# EAGLE design KMO_IO_MV1_1a (EAGLE 9.2.2)

## Sheet 1 of 2
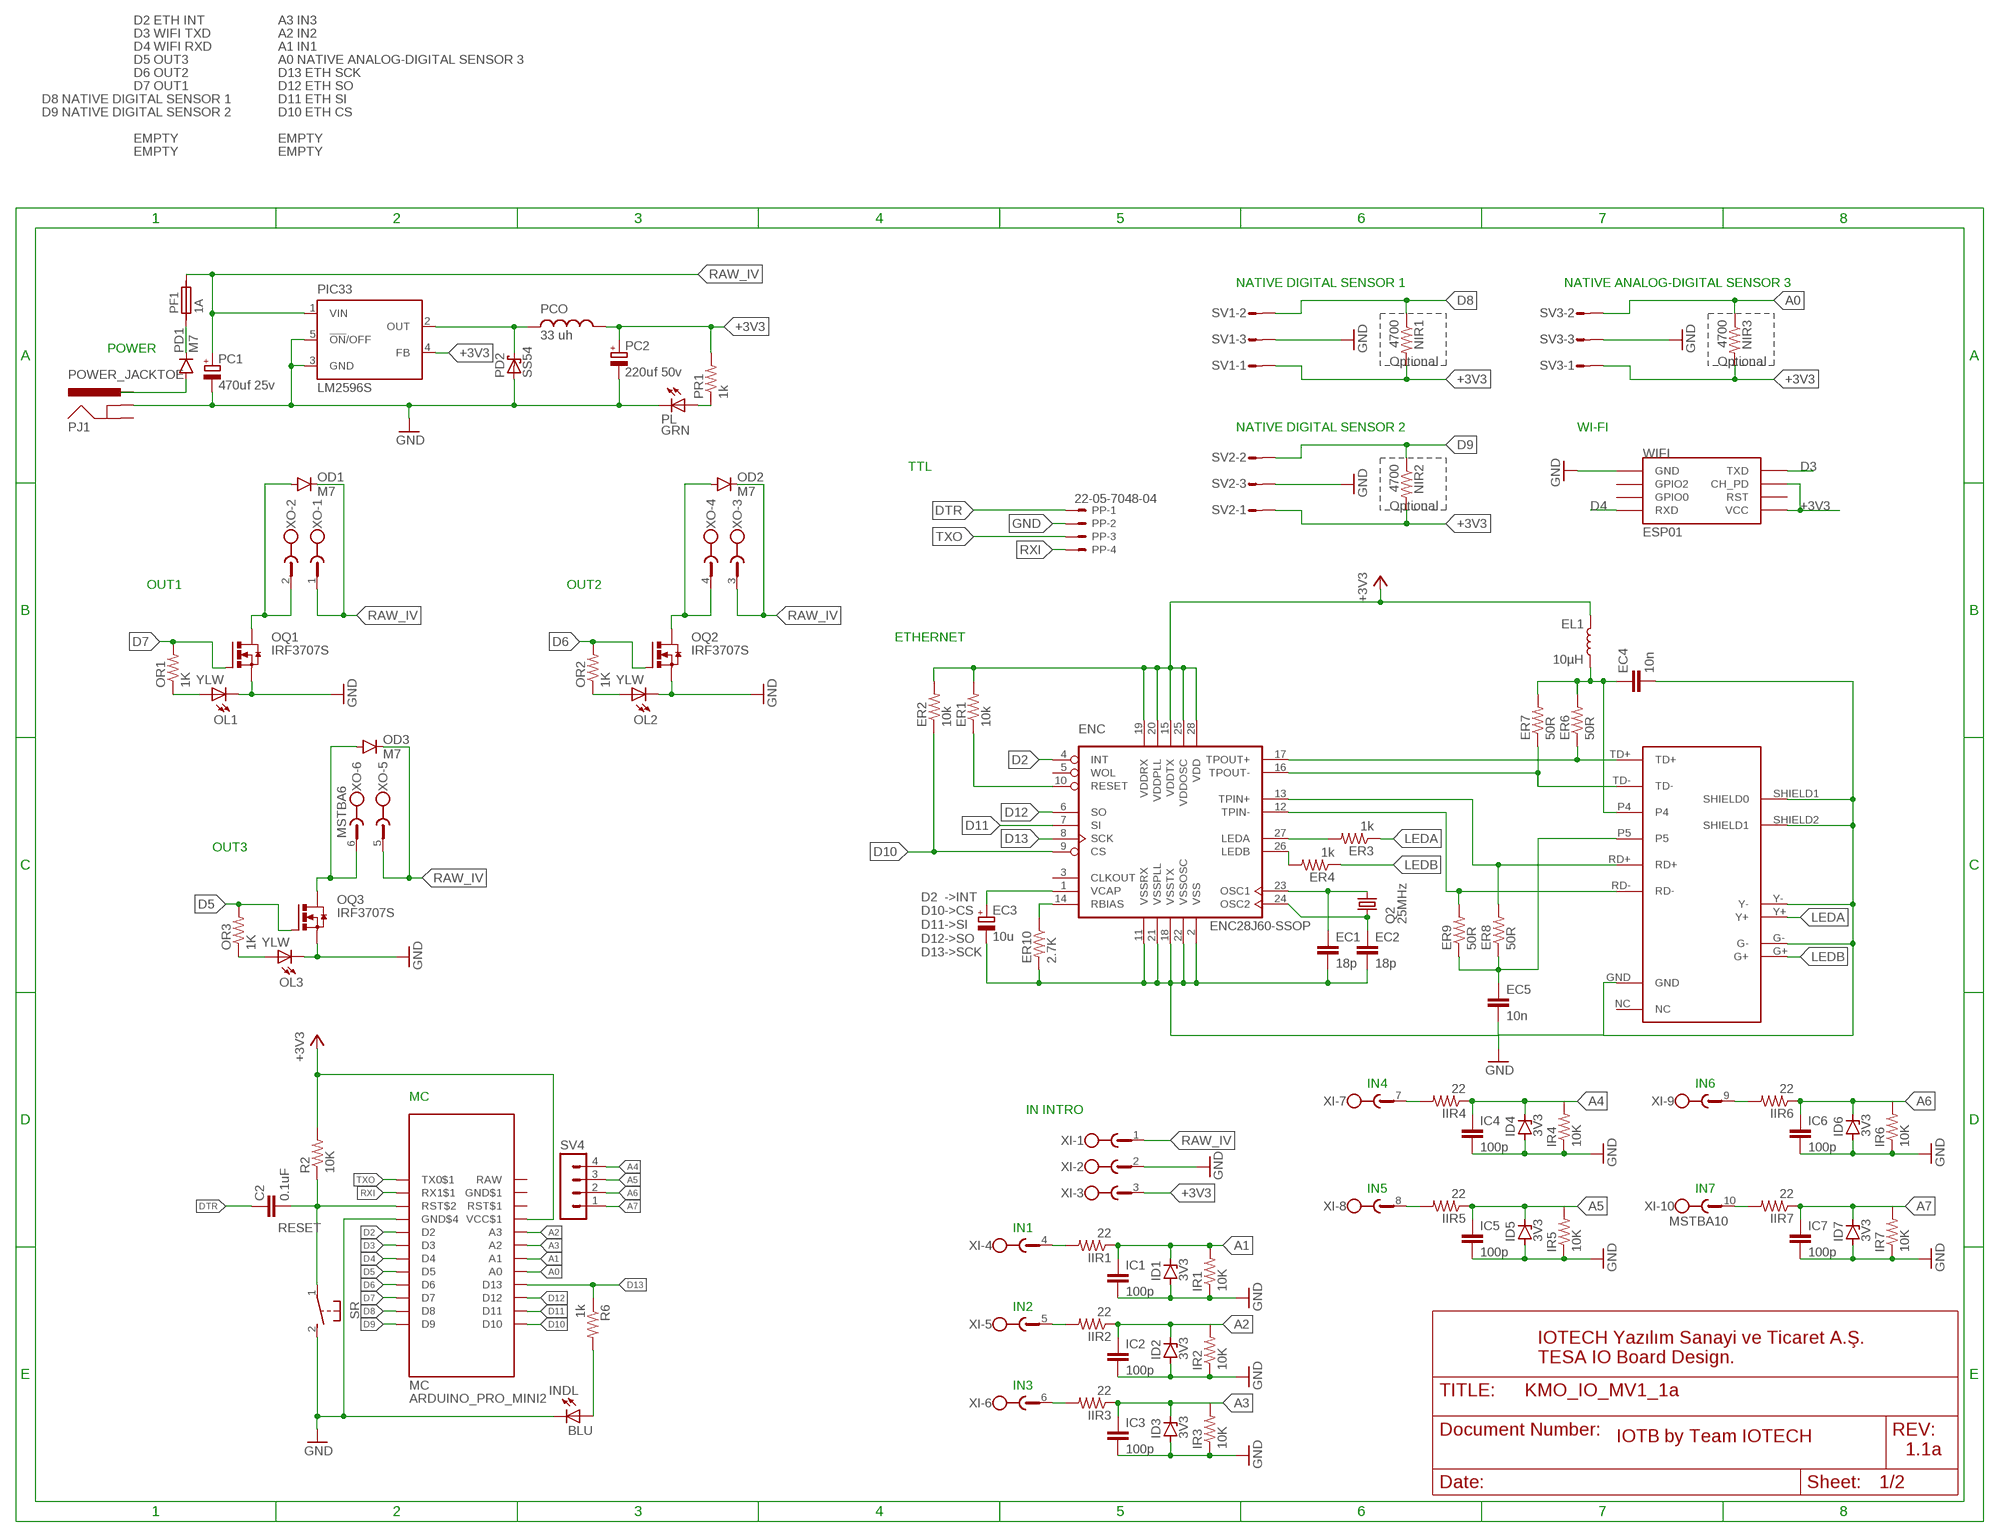
[diagram p0: schematic, sheet 1]

### Parts
C2  0.1uF  CAP0805  [0805]
EC1  18p  CAP0805  [0805]
EC2  18p  CAP0805  [0805]
EC3  10u  CPOL-EUCT3216  [CT3216]
EC4  10n  CAP0805  [0805]
EC5  10n  CAP0805  [0805]
EL1  10µH  INDUCTOR-0805-3.3UH  [0805]
ENC  ENC28J60-SSOP  [SSOP28]
ER1  10k  RESISTOR0805-RES  [0805]
ER2  10k  RESISTOR0805-RES  [0805]
ER3  1k  RESISTOR0805-RES  [0805]
ER4  1k  RESISTOR0805-RES  [0805]
ER6  50R  RESISTOR0805-RES  [0805]
ER7  50R  RESISTOR0805-RES  [0805]
ER8  50R  RESISTOR0805-RES  [0805]
ER9  50R  RESISTOR0805-RES  [0805]
ER10  2.7K  RESISTOR0805-RES  [0805]
IC1  100p  CAP0805  [0805]
IC2  100p  CAP0805  [0805]
IC3  100p  CAP0805  [0805]
IC4  100p  CAP0805  [0805]
IC5  100p  CAP0805  [0805]
IC6  100p  CAP0805  [0805]
IC7  100p  CAP0805  [0805]
ID1  3V3  ZENER-DIODESOT23  [SOT23]
ID2  3V3  ZENER-DIODESOT23  [SOT23]
ID3  3V3  ZENER-DIODESOT23  [SOT23]
ID4  3V3  ZENER-DIODESOT23  [SOT23]
ID5  3V3  ZENER-DIODESOT23  [SOT23]
ID6  3V3  ZENER-DIODESOT23  [SOT23]
ID7  3V3  ZENER-DIODESOT23  [SOT23]
IIR1  22  RESISTOR0805-RES  [0805]
IIR2  22  RESISTOR0805-RES  [0805]
IIR3  22  RESISTOR0805-RES  [0805]
IIR4  22  RESISTOR0805-RES  [0805]
IIR5  22  RESISTOR0805-RES  [0805]
IIR6  22  RESISTOR0805-RES  [0805]
IIR7  22  RESISTOR0805-RES  [0805]
INDL  BLU  LEDCHIP-LED0805  [CHIP-LED0805]
IR1  10K  RESISTOR0805-RES  [0805]
IR2  10K  RESISTOR0805-RES  [0805]
IR3  10K  RESISTOR0805-RES  [0805]
IR4  10K  RESISTOR0805-RES  [0805]
IR5  10K  RESISTOR0805-RES  [0805]
IR6  10K  RESISTOR0805-RES  [0805]
IR7  10K  RESISTOR0805-RES  [0805]
MC  ARDUINO_PRO_MINI2  [ARDUINO_PRO_MINI2]
NIR1  4700  RESISTOR0805-RES  [0805]
NIR2  4700  RESISTOR0805-RES  [0805]
NIR3  4700  RESISTOR0805-RES  [0805]
OD1  M7  DIODESMA  [SMA-DIODE]
OD2  M7  DIODESMA  [SMA-DIODE]
OD3  M7  DIODESMA  [SMA-DIODE]
OL1  YLW  LEDCHIP-LED0805  [CHIP-LED0805]
OL2  YLW  LEDCHIP-LED0805  [CHIP-LED0805]
OL3  YLW  LEDCHIP-LED0805  [CHIP-LED0805]
OQ1  IRF3707S  IRF3704S  [D2PACK]
OQ2  IRF3707S  IRF3704S  [D2PACK]
OQ3  IRF3707S  IRF3704S  [D2PACK]
OR1  1K  RESISTOR0805-RES  [0805]
OR2  1K  RESISTOR0805-RES  [0805]
OR3  1K  RESISTOR0805-RES  [0805]
PC1  470uf 25v  CPOL-EU140CLH-1010  [140CLH-1010]
PC2  220uf 50v  CPOL-EU140CLH-1010  [140CLH-1010]
PCO  33 uh  MSS1260  [MSS1260]
PD1  M7  DIODESMA  [SMA-DIODE]
PD2  SS54  SCHOTTKY-DIODESMD  [SMB]
PF1  1A  SIBA194600  [1820]
PIC33  LM2596S  [TO263-5]
PJ1  POWER_JACKTOE  [POWER_JACK_SMD_OVERPASTE_TOE]
PL  GRN  LEDCHIP-LED0805  [CHIP-LED0805]
PP  22-05-7048-04  [7395-04]
PR1  1k  RESISTOR0805-RES  [0805]
Q2  25MHz  KX-9B  [5.0X3.2_2]
R2  10K  RESISTOR0805-RES  [0805]
R6  1k  RESISTOR0805-RES  [0805]
SR  31-XX  [B3F-31XX]
SV1  S03P  [S03P]
SV2  S03P  [S03P]
SV3  S03P  [S03P]
SV4  MA04-1  [MA04-1]
U$2  HR911105A  [RJ45]
WIFI  ESP01  [ESP01]
XI  MSTBA10  [MSTBA10]
XO  MSTBA6  [MSTBA6]

### Nets
+3V3: EL1.1 ENC.15(VDDTX) ENC.19(VDDRX) ENC.20(VDDPLL) ENC.25(VDDOSC) ENC.28(VDD) ER1.2 ER2.2 MC.VCC$1 NIR1.2 NIR2.2 NIR3.2 PC2.+ PCO.P$1 PIC33.4(FB) PR1.2 R2.2 SV1.1 SV2.1 SV3.1 WIFI.CH_PD WIFI.VCC XI.3
A0: MC.A0 NIR3.1 SV3.2
A1: IC1.1 ID1.3(C) IIR1.1 IR1.2 MC.A1
A2: IC2.1 ID2.3(C) IIR2.1 IR2.2 MC.A3
A3: IC3.1 ID3.3(C) IIR3.1 IR3.2 MC.A2
A4: IC4.1 ID4.3(C) IIR4.1 IR4.2 SV4.4
A5: IC5.1 ID5.3(C) IIR5.1 IR5.2 SV4.3
A6: IC6.1 ID6.3(C) IIR6.1 IR6.2 SV4.2
A7: IC7.1 ID7.3(C) IIR7.1 IR7.2 SV4.1
D2: ENC.4(INT) MC.D2
D3: MC.D3 WIFI.TX(TXD)
D4: MC.D4 WIFI.RX(RXD)
D5: MC.D5 OQ3.1(G) OR3.2
D6: MC.D6 OQ2.1(G) OR2.2
D7: MC.D7 OQ1.1(G) OR1.2
D8: MC.D8 NIR1.1 SV1.2
D9: MC.D9 NIR2.1 SV2.2
D10: ENC.9(CS) ER2.1 MC.D10
D11: ENC.7(SI) MC.D11
D12: ENC.6(SO) MC.D12
D13: ENC.8(SCK) MC.D13 R6.1
DTR: C2.2 PP.1
EP4: EC4.1 EL1.2 ER6.2 ER7.2 U$2.P4
EP5: EC5.1 ER8.1 ER9.1 U$2.P5
GND: EC1.2 EC2.2 EC3.- EC4.2 EC5.2 ENC.2(VSS) ENC.11(VSSRX) ENC.18(VSSTX) ENC.21(VSSPLL) ENC.22(VSSOSC) ER10.2 IC1.2 IC2.2 IC3.2 IC4.2 IC5.2 IC6.2 IC7.2 ID1.1(A) ID2.1(A) ID3.1(A) ID4.1(A) ID5.1(A) ID6.1(A) ID7.1(A) INDL.C IR1.1 IR2.1 IR3.1 IR4.1 IR5.1 IR6.1 IR7.1 MC.GND$4 OL1.C OL2.C OL3.C OQ1.3(S) OQ2.3(S) OQ3.3(S) PC1.- PC2.- PD2.A PIC33.3(GND) PIC33.5(!ON!/OFF) PJ1.GND(GNDBREAK) PL.C PP.2 SR.2(S) SV1.3 SV2.3 SV3.3 U$2.G- U$2.GND U$2.SHIELD1(SHIELD0) U$2.SHIELD2(SHIELD1) U$2.Y- WIFI.GND XI.2
LEDA: ER3.1 U$2.Y+
LEDB: ER4.1 U$2.G+
N$1: OD3.A OQ3.2(D) XO.6
N$2: PD1.C PF1.1
N$3: OD1.A OQ1.2(D) XO.2
N$4: OD2.A OQ2.2(D) XO.4
N$5: INDL.A R6.2
N$6: OL3.A OR3.1
N$7: OL2.A OR2.1
N$8: OL1.A OR1.1
N$9: ENC.27(LEDA) ER3.2
N$11: PL.A PR1.1
N$12: IIR1.2 XI.4
N$13: EC3.+ ENC.1(VCAP)
N$14: ENC.26(LEDB) ER4.2
N$16: PCO.P$2 PD2.C PIC33.2(OUT)
N$17: ENC.10(RESET) ER1.1
N$18: PD1.A PJ1.VIN0(PWR)
N$19: ENC.14(RBIAS) ER10.1
N$20: IIR2.2 XI.5
N$21: IIR3.2 XI.6
N$22: EC2.1 ENC.24(OSC2) Q2.1
N$23: IIR4.2 XI.7
N$24: EC1.1 ENC.23(OSC1) Q2.2
N$25: IIR5.2 XI.8
N$26: IIR6.2 XI.9
N$27: IIR7.2 XI.10
RAW_IV [vcc]: OD1.C OD2.C OD3.C PC1.+ PF1.2 PIC33.1(VIN) XI.1 XO.1 XO.3 XO.5
RD+: ENC.13(TPIN+) ER8.2 U$2.RD+
RD-: ENC.12(TPIN-) ER9.2 U$2.RD-
RESET: C2.1 MC.RST$2 R2.1 SR.1(P)
RXI: MC.RX1$1 PP.4
TD+: ENC.17(TPOUT+) ER6.1 U$2.TD+
TD-: ENC.16(TPOUT-) ER7.1 U$2.TD-
TXO: MC.TX0$1 PP.3
Unconnected: ENC.3(CLKOUT) ENC.5(WOL) MC.RST$1 PJ1.P$4(GND) U$2.NC WIFI.GPIO0 WIFI.GPIO2 WIFI.RST

### Notes on the sheet
- D2 ETH INT | A3 IN3
- D3 WIFI TXD | A2 IN2
- D4 WIFI RXD | A1 IN1
- D5 OUT3 | A0 NATIVE ANALOG-DIGITAL SENSOR 3
- D6 OUT2 | D13 ETH SCK
- D7 OUT1 | D12 ETH SO
- D8 NATIVE DIGITAL SENSOR 1 | D11 ETH SI
- D9 NATIVE DIGITAL SENSOR 2 | D10 ETH CS
- EMPTY | EMPTY
- EMPTY | EMPTY
- NATIVE DIGITAL SENSOR 1 | NATIVE ANALOG-DIGITAL SENSOR 3
- POWER
- Optional | Optional
- NATIVE DIGITAL SENSOR 2 | WI-FI
- TTL
- Optional
- OUT1 | OUT2
- ETHERNET
- OUT3
- D2  ->INT
  D10->CS
  D11->SI
  D12->SO
  D13->SCK
- IN4 | IN6
- MC
- IN INTRO
- IN5 | IN7
- IN1
- IN2
- IOTECH Yazılım Sanayi ve Ticaret A.Ş.
  TESA IO Board Design.
- IN3
- IOTB by Team IOTECH
- 1.1a

## Sheet 2 of 2
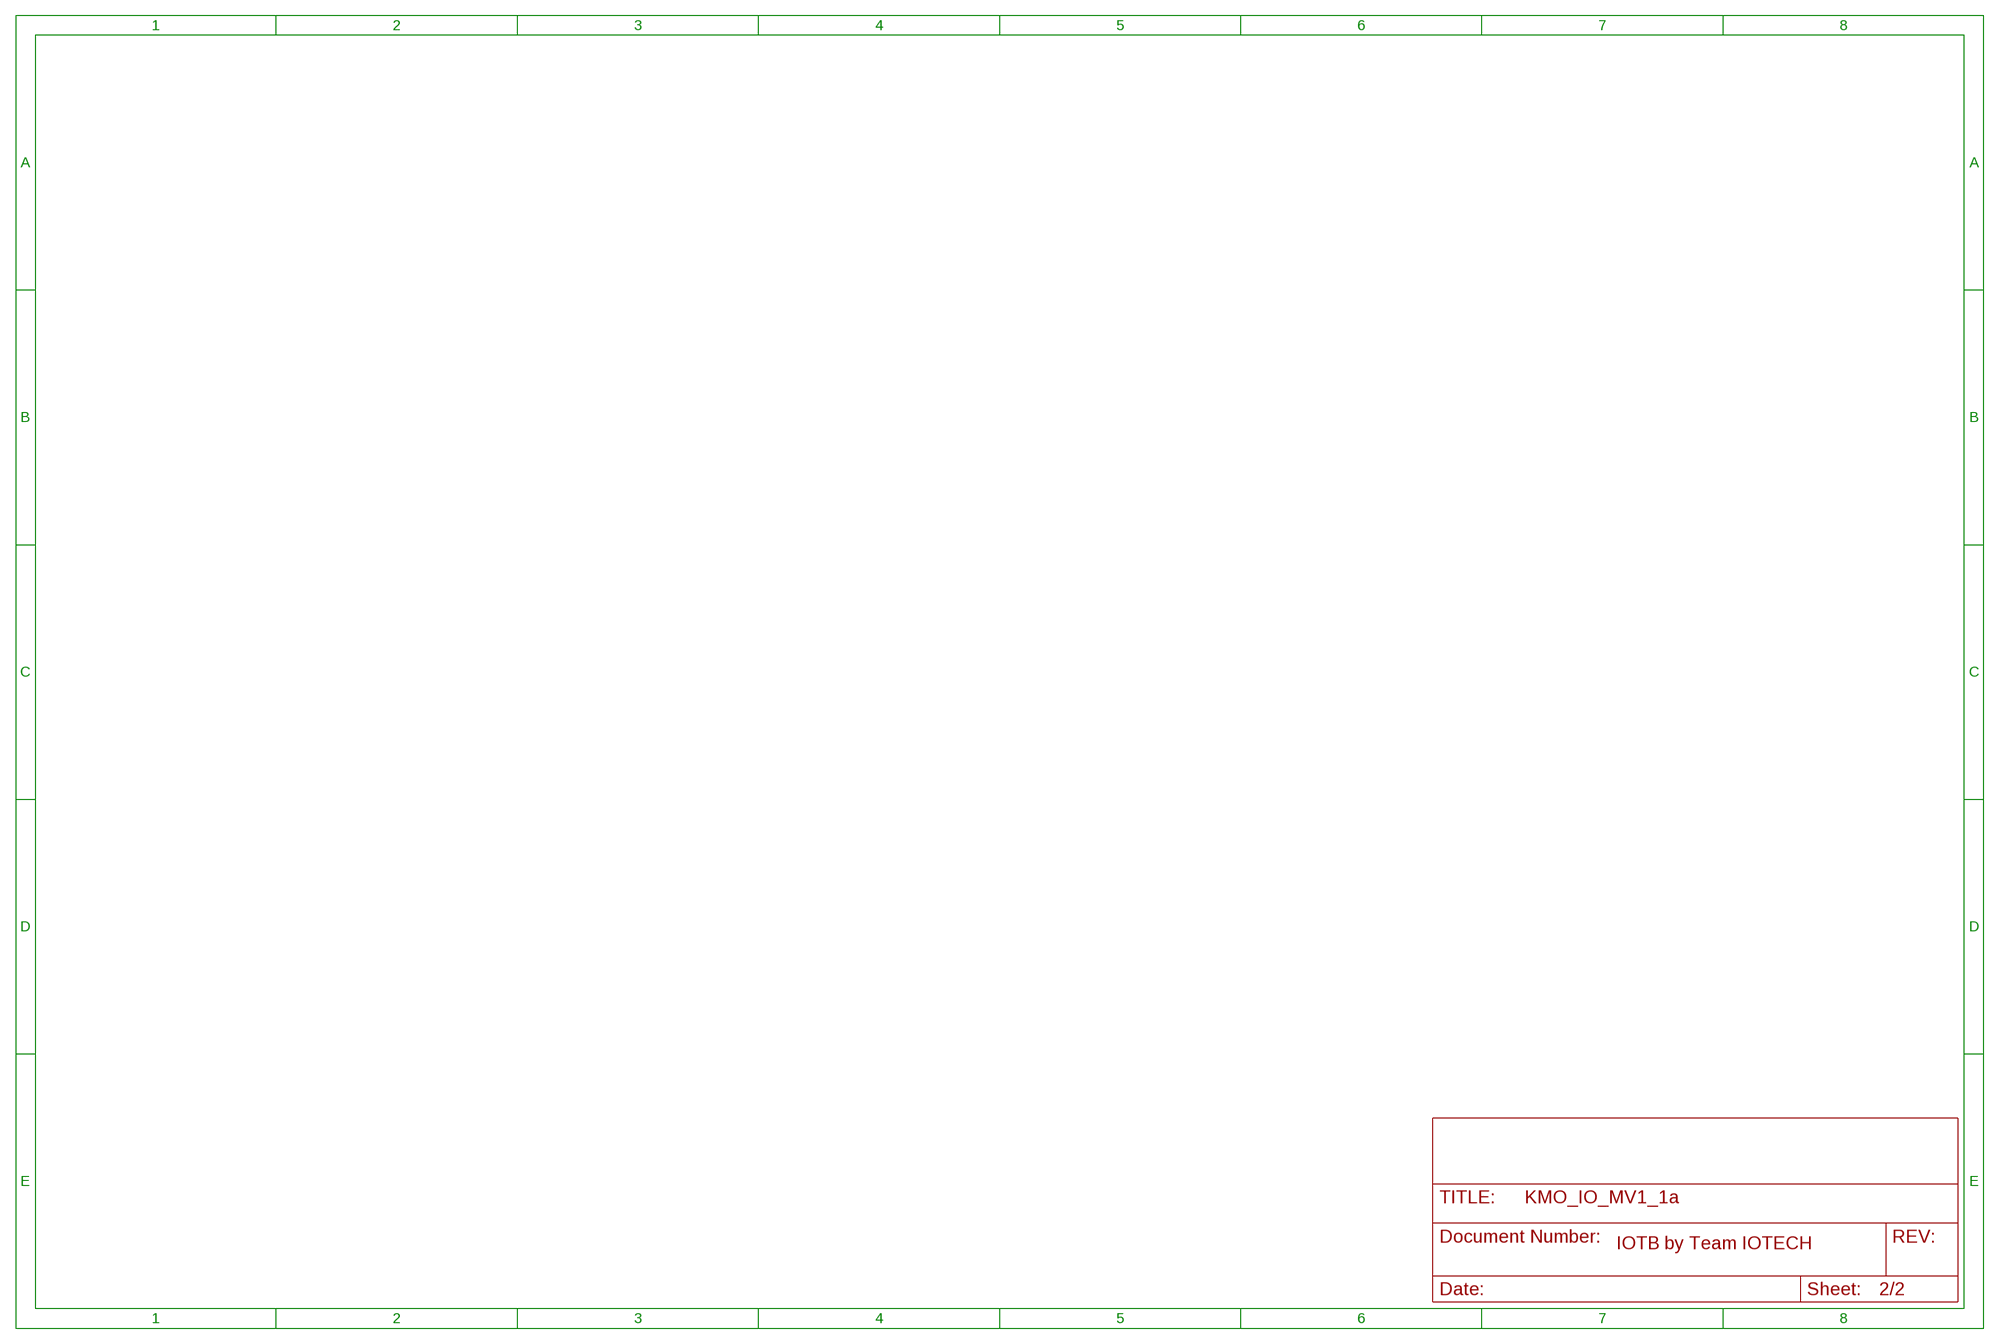
[diagram p1: schematic, sheet 2]

### Notes on the sheet
- IOTB by Team IOTECH

## Power pins joined to a net without a drawn wire
GND$1: MC.GDN$1(GND$1)
RAW: MC.RAW

## Library data of the parts
C2 EC1 EC2 EC4 EC5 IC1-IC7 = SparkFun-Passives:CAP: Capacitor Standard 0603 ceramic capacitor, and 0.1" leaded capacitor.
EC3 PC1 PC2 = rcl:CPOL-EU: POLARIZED CAPACITOR, European symbol; SPICEPREFIX: C
EL1 = SparkFun-Coils:INDUCTOR: Inductors Resist changes in electrical current. Basically a coil of wire. SparkFun Products: SparkFun Load Cell Amplifier - HX711 <https://www.sparkfun.com/products/13879> IOIO-OTG - V2.2 <https://www.sparkfun.com/products/13613>; PROD_ID: NDUC-13076; VALUE: 3.3µH/±20%/450mA
ENC = microchip-enc28j60:ENC28J60-*: Microchip 10Mbit Eth. contoller with SPI interface
ER1-ER4 ER6-ER10 IIR1-IIR7 IR1-IR7 NIR1-NIR3 OR1-OR3 PR1 R2 R6 = SparkFun-Passives:RESISTOR: Resistor Basic schematic elements and footprints for 0603, 1206, and PTH resistors.
ID1-ID7 = diode:ZENER-DIODE: Z-Diode
INDL OL1-OL3 PL = led:LED: LED OSRAM: - CHIPLED LG R971, LG N971, LY N971, LG Q971, LY Q971, LO R971, LY R971 LH N974, LH R974 LS Q976, LO Q976, LY Q976 LO Q996 - Hyper CHIPLED LW Q18S LB Q993, LB Q99A, LB R99A - SideLED LS A670, LO A670, LY A670, LG A670, LP A670 LB A673, LV A673, LT A673, LW A673 LH A674 LY A675 LS A676, LA A676, LO A676, LY A676, LW A676 LS A679, LY A679, LG A679 - Hyper Micro SIDELED® LS Y876, LA Y876, LO Y876, LY Y876 LT Y87S - SmartLED LW L88C, LW L88S LB L89C, LB L89S, LG L890 LS L89K, LO L89K, LY L89K LS L896, LA L896, LO L896, LY L896 - TOPLED LS T670, LO T670, LY T670, LG T670, LP T670 LSG T670, LSP T670, LSY T670, LOP T670, LYG T670 LG T671, LOG T671, LSG T671 LB T673, LV T673, LT T673, LW T673 LH T674 LS T676, LA T676, LO T676, LY T676, LB T676, LH T676, LSB T676, LW T676 LB T67C, LV T67C, LT T67C, LS T67K, LO T67K, LY T67K, LW E67C LS E67B, LA E67B, LO E67B, LY E67B, LB E67C, LV E67C, LT E67C LW T67C LS T679, LY T679, LG T679 LS T770, LO T770, LY T770, LG T770, LP T770 LB T773, LV T773, LT T773, LW T773 LH T774 LS E675, LA E675, LY E675, LS T675 LS T776, LA T776, LO T776, LY T776, LB T776 LHGB T686 LT T68C, LB T68C - Hyper Mini TOPLED® LB M676 - Mini TOPLED Santana® LG M470 LS M47K, LO M47K, LY M47K Source: http://www.osram.convergy.de LUXEON: - LUMILED® LXK2-PW12-R00, LXK2-PW12-S00, LXK2-PW14-U00, LXK2-PW14-V00 LXK2-PM12-R00, LXK2-PM12-S00, LXK2-PM14-U00 LXK2-PE12-Q00, LXK2-PE12-R00, LXK2-PE12-S00, LXK2-PE14-T00, LXK2-PE14-U00 LXK2-PB12-K00, LXK2-PB12-L00, LXK2-PB12-M00, LXK2-PB14-N00, LXK2-PB14-P00, LXK2-PB14-Q00 LXK2-PR12-L00, LXK2-PR12-M00, LXK2-PR14-Q00, LXK2-PR14-R00 LXK2-PD12-Q00, LXK2-PD12-R00, LXK2-PD12-S00 LXK2-PH12-R00, LXK2-PH12-S00 LXK2-PL12-P00, LXK2-PL12-Q00, LXK2-PL12-R00 Source: www.luxeon.com KINGBRIGHT: KA-3528ASYC Source: www.kingbright.com
MC = personal_srgPersonal:ARDUINO_PRO_MINI2
OD1-OD3 PD1 = SparkFun-DiscreteSemi:DIODE: Diode These are standard reverse protection diodes and small signal diodes. SMA package can handle up to about 1A. SOD-323 can handle about 200mA. What the SOD-323 package when ordering, there are some mfgs out there that are 5-pin packages.
OQ1-OQ3 = transistor-power:IRF3704: SMPS MOSFET HEXFET® Power MOSFET Source: http://www.irf.com/product-info/datasheets/data/irf3704.pdf
PCO = inductor-coilcraft:MSS1260: SMT Power Inductor
PD2 = diode:SCHOTTKY-DIODE: Schottky Diode
PF1 = _hhn_PtcFuses_Siba_r500_Ozan:SIBA194600*: SIBA PTC-Fuses, Series 194600, 1812 (4.5 3.2)mm Source: www.siba.de/ Package: SMD 1812 (4.5 x 3.2)mm Technologies: SIBA194600Axxx xxx: Trip-Current * 10 mA Author: Dipl.-Ing. FH Rainer Bayer
PIC33 = national-semiconductor:LM2596: SIMPLE SWITCHER® Power Converter 150 kHz 3A Step-Down Voltage Regulator Source: http://www.national.com/ds/LM/LM2596.pdf; MF: NATIONAL SEMICONDUCTOR; MPN: LM2596S-ADJ/NOPB; OC_FARNELL: 9494367; OC_NEWARK: 41K3842
PJ1 = SparkFun-Connectors:POWER_JACK: Power Jack Connector This is the standard 5.5mm barrel jack for power. The PTH is the most common, proven, reliable, footprint. The Slot footprint only works if the mill layer is transmitted to the PCB fab house so be warned. Here are the connectors we sell at SparkFun: DC Barrel Power Jack/Connector <https://www.sparkfun.com/products/119> (PRT-00119) DC Barrel Power Jack/Connector (SMD) <https://www.sparkfun.com/products/12748> (PRT-12748) DC Barrel Jack Adapter - Breadboard Compatible <https://www.sparkfun.com/products/10811> (PRT-10811) It is used on this SparkFun product (and many, many others): SparkFun RedBoard - Programmed with Arduino <https://www.sparkfun.com/products/12757> (DEV-12757) Also, if you need a mating power supply or connector, please check these out: Wall Adapter Power Supply - 9VDC 650mA <https://www.sparkfun.com/products/298> (TOL-00298) DC Barrel Jack Adapter - Male <https://www.sparkfun.com/products/10287> (PRT-10287); PROD_ID: CONN-08106; SF_ID: PRT-12748
PP = con-molex:22-?-04: CONNECTOR wire to board 2.54 mm (.1 inch) pitch header; MF: MOLEX; OC_FARNELL: unknown; OC_NEWARK: unknown
Q2 = crystal-geyer_V1_0:KX: Quartz Crystals (MHz) SMD: KX - Serie Model Size l/w/h [mm] Frequency Range Frequency Stability Temp. Range [°C] Load Capacitance AECQ 200 availabel Datasheet KX-4 KX-5 KX-6 KX-7 KX-9A KX-9B KX-12A KX-12B KX-13 KX-20 KX-K KX-KS 1.6/1.2/0.3 2.0/1.6/0.45 2.5/2.0/0.55 3.2/2.5/0.8 5.0/3.2/1.0 5.0/3.2/1.1 6.0/3.5/1.1 6.0/3.5/1.0 7.0/5.0 /1.3 11.6/5.5/1.6 12.3/4.5/4.2 12.3/4.5/3.2 24.0 ~ 80.0 MHz 16.0 ~ 80.0 MHz 12.0 ~ 80.0 MHz 8.0 ~ 60.0 MHz 7,68 ~ 300,0 MHz 8,0 ~ 50,0 MHz 8,0 ~ 150,0 MHz 8,0 ~ 50,0 MHz 6,0 ~ 160,0 MHz 3,579 ~ 25,0 MHz 3,579 ~ 70,0 MHz 3,579 ~ 70,0 MHz ±10 … ±50ppm ±10 … ±50ppm ±10 … ±50ppm ±10 … ±50ppm ±10 … ±50ppm ±10 … ±50ppm ±10 … ±50ppm ±10 … ±50ppm ±10 … ±50ppm ±50ppm ±10 … ±50ppm ±10 … ±50ppm (*) -40°C …+85°C (*) -40°C …+125°C (*) -40°C …+125°C (*) -40°C …+125°C (*) -40°C …+105°C (*) -40°C …+105°C (*) -40°C …+125°C (*) -40°C …+105°C (*) -40°C …+105°C (*) -40°C …+105°C (*) -40°C …+85°C (*) -40°C …+85°C 8, 8…16 8, 8…16 10, 8…16 12, 7…20 16, 10…20 16, 10…20 16, 10…20 16, 12…20 16, 12…20 16, 12…20 16, 12…30 16, 12…30 - yes yes yes - - - - - - - - KX-4.pdf <http://www.geyer-electronic.de/uploads/tx_userartikelfrequenz/GEYER-KX-4.pdf> KX-5.pdf <http://www.geyer-electronic.de/uploads/tx_userartikelfrequenz/GEYER-KX-5.pdf> KX-6.pdf <http://www.geyer-electronic.de/uploads/tx_userartikelfrequenz/GEYER-KX-6.pdf> KX-7.pdf <http://www.geyer-electronic.de/uploads/tx_userartikelfrequenz/GEYER-KX-7.pdf> KX-9A.pdf <http://www.geyer-electronic.de/uploads/tx_userartikelfrequenz/GEYER-KX-9A.pdf> KX-9B.pdf <http://www.geyer-electronic.de/uploads/tx_userartikelfrequenz/GEYER-KX-9B.pdf> KX-12A.pdf <http://www.geyer-electronic.de/uploads/tx_userartikelfrequenz/GEYER-KX-12A.pdf> KX-12B.pdf <http://www.geyer-electronic.de/uploads/tx_userartikelfrequenz/GEYER-KX-12B.pdf> KX-13.pdf <http://www.geyer-electronic.de/uploads/tx_userartikelfrequenz/GEYER-KX-13.pdf> KX-20.pdf <http://www.geyer-electronic.de/uploads/tx_userartikelfrequenz/GEYER-KX-20.pdf> KX-K.pdf <http://www.geyer-electronic.de/uploads/tx_userartikelfrequenz/GEYER-KX-K.pdf> KX-KS.pdf <http://www.geyer-electronic.de/uploads/tx_userartikelfrequenz/GEYER-KX-KS.pdf> <http://www.geyer-electronic.de/fileadmin/template/img/logo-geyer-electronic.png> Details see: http://www.geyer-electronic.de/Frequenz-Produkte.9.0.html Created 2016-06-07, Hans Locher 2016 (C) Geyer Quartz Technology KX4,KX5,KX6,KX7,KX9A,KX9B,KX12A,KX12B,KX13,KX20,KXK,KXKS;1612;2016;2520;3225;5032;6035;7050;11655;12345;1,6x1,2;2,0x1,6;2,5x2,0;3,2x2,5;5,0x3,2;6,0x3,5;7,0x5,0;11,6x5,5;12,3x4,5;12,3x4,5;1.6x1.2;2.0x1.6;2.5x2.0;3.2x2.5;5.0x3.2;6.0x3.5;7.0x5.0;11.6x5.5;12.3x4.5;12.3x4.5;
SR = switch-omron:31-XX: OMRON SWITCH; MPN: B3F-3100; OC_FARNELL: 959704; OC_NEWARK: 36M3582
SV1-SV3 = con_io_sxp:S03P: AMP MT CONNECTOR
SV4 = con-lstb:MA04-1: PIN HEADER; OC_FARNELL: unknown; OC_NEWARK: unknown
U$2 = HR911105A:HR911105A
WIFI = esp8266modules:ESP01: ESP8266 Wifi module 01
XI = con-phoenix-508:MSTBA10: PHOENIX; MF: FARNELL; MPN: 1757323; OC_FARNELL: 3705249; OC_NEWARK: 71C4168
XO = con-phoenix-508:MSTBA6: PHOENIX; MF: FARNELL; MPN: 1757284; OC_FARNELL: 3705213; OC_NEWARK: 71C4165

## Net classes
0 default: width 0.203 mm, drill 0.3 mm, clearance 0.16 mm
1 vcc: width 0.254 mm, drill 0.3 mm, clearance 0.16 mm

## Board
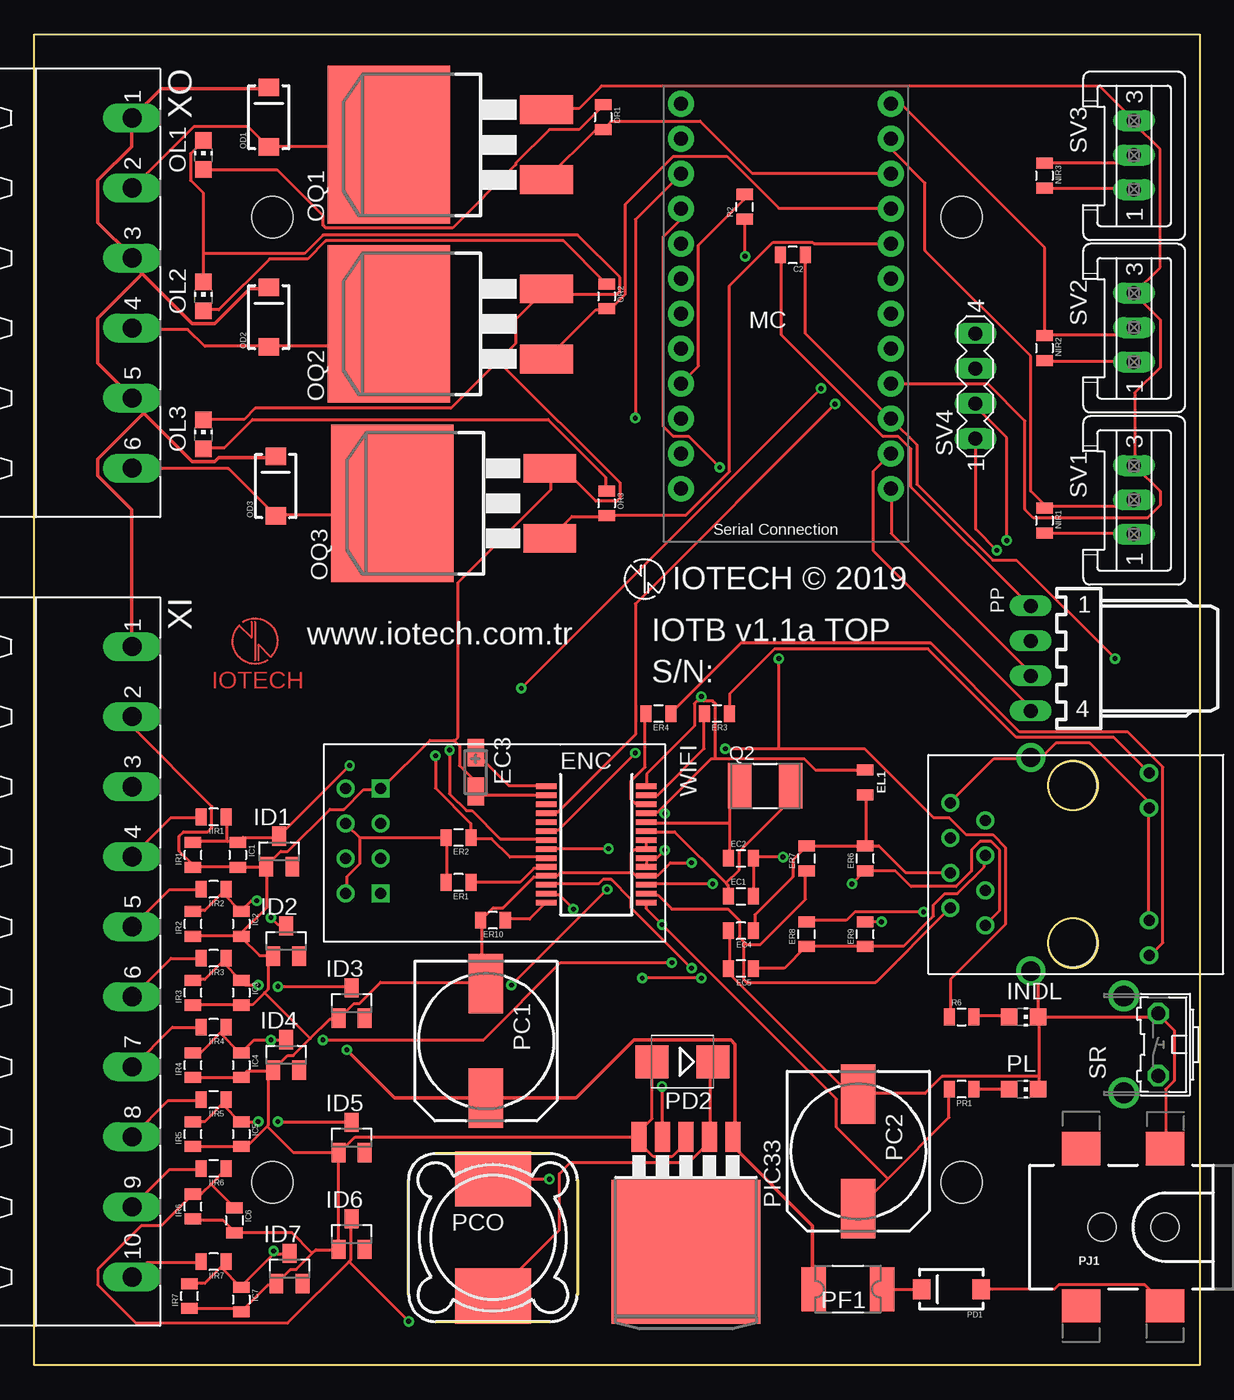
[diagram p2: board, top side]
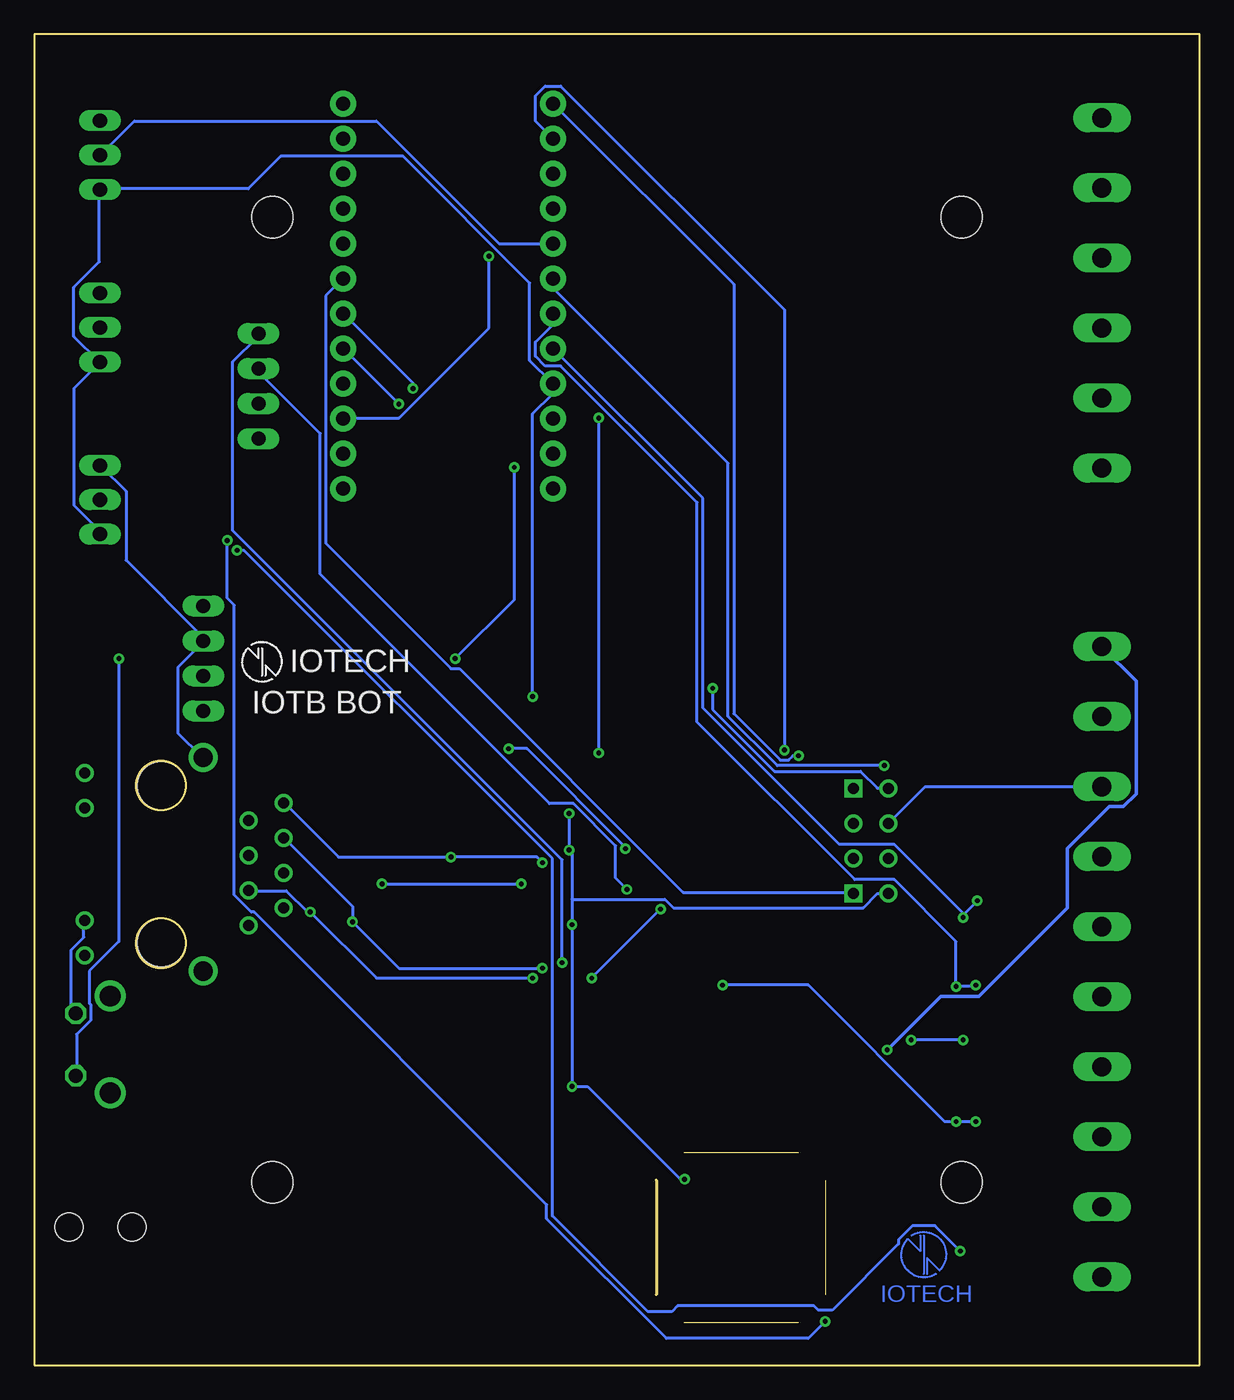
[diagram p3: board, bottom side, seen from below]

Size 84.5 x 96.5 mm. Coordinates in mm from the lower left corner, seen from the top.
Outline: 0,0 0,96.5 84.5,96.5 84.5,0 0,0
Copper layers (1*16): Top 0.035mm / dielectric 1.5mm / Bottom 0.035mm
Design rules "KMO_IO_M": minimum track width 6mil, minimum drill 0.35mm, track to track 0.205mm, track to pad 0.205mm, pad to pad 0.205mm, via to via 0.205mm, smd to smd 6mil, copper to edge 40mil, drill to drill 6mil, minimum pad ring 10mil, minimum via ring 8mil, stop-mask expansion 4mil, vias tented up to drill 0mil, thermal gap 10mil
Holes 3 mm at 17.25,83.25 67.25,83.25 17.25,13.25 67.25,13.25

### Footprints (pad centres in the part's own frame; a part is rotated, then mirrored left to right if it is on the bottom)
0805 = smd 0.8 x 1.2: 1 -0.9,0; 2 0.9,0
CT3216 = smd 2 x 1.2: + -1.4,0; - 1.4,0
SSOP28 = smd 0.4 x 1.5: 1 -4.225,-3.625; 2 -3.575,-3.625; 3 -2.925,-3.625; 4 -2.275,-3.625; 5 -1.625,-3.625; 6 -0.975,-3.625; 7 -0.325,-3.625; 8 0.325,-3.625; 9 0.975,-3.625; 10 1.625,-3.625; 11 2.275,-3.625; 12 2.925,-3.625; 13 3.575,-3.625; 14 4.225,-3.625; 15 4.225,3.625; 16 3.575,3.625; 17 2.925,3.625; 18 2.275,3.625; 19 1.625,3.625; 20 0.975,3.625; 21 0.325,3.625; 22 -0.325,3.625; 23 -0.975,3.625; 24 -1.625,3.625; 25 -2.275,3.625; 26 -2.925,3.625; 27 -3.575,3.625; 28 -4.225,3.625
SOT23 = smd 1 x 1.4: 1 -0.95,-1.1; 2 0.95,-1.1; 3 0,1.1
CHIP-LED0805 = smd 1.2 x 1.2: A 0,-1.05; C 0,1.05
ARDUINO_PRO_MINI2 = drill 1.016 pad 1.88: A0 7.62,-5.08; A1 7.62,-2.54; A2 7.62,0; A3 7.62,2.54; D2 -7.62,2.54; D3 -7.62,0; D4 -7.62,-2.54; D5 -7.62,-5.08; D6 -7.62,-7.62; D7 -7.62,-10.16; D8 -7.62,-12.7; D9 -7.62,-15.24; D10 7.62,-15.24; D11 7.62,-12.7; D12 7.62,-10.16; D13 7.62,-7.62; GDN$1 7.62,10.16; GND$4 -7.62,5.08; RAW 7.62,12.7; RST$1 7.62,7.62; RST$2 -7.62,7.62; RX1$1 -7.62,10.16; TX0$1 -7.62,12.7; VCC$1 7.62,5.08
SMA-DIODE = smd 1.27 x 1.47: A -2.15,0; C 2.15,0
D2PACK = smd 2.083 x 3.81: 1 -2.54,-8.89; 3 2.54,-8.89 | smd 11.43 x 8.89: 2 0,2.54
140CLH-1010 = smd 4.3 x 2.5: + 4.15,0; - -4.15,0
MSS1260 = smd 5.5 x 4: P$1 0,4.25; P$2 0,-4.25
SMB = smd 2.4 x 2.4: A 2.2,0; C -2.2,0
1820 = smd 1.78 x 3.2: 1 -2.49,0; 2 2.49,0
TO263-5 = smd 1.067 x 2.159: 1 -3.404,-5.791; 2 -1.702,-5.791; 3 0,-5.791; 4 1.702,-5.791; 5 3.404,-5.791 | smd 10.8 x 10.41: 6 0,2.54
POWER_JACK_SMD_OVERPASTE_TOE = smd 2.8 x 2.4: GND 0,-5.7; P$4 6.1,-5.7; VIN0 0,5.7; VIN1 6.1,5.7 | hole 2.032: 0,0; 4.572,0
7395-04 = drill 1.016 long: 1 3.81,0; 2 1.27,0; 3 -1.27,0; 4 -3.81,0
5.0X3.2_2 = smd 1.7 x 3.3: 1 -1.85,0; 2 1.85,0
B3F-31XX = drill 1.016 octagon: 1 -2.261,-1.245; 2 2.261,-1.245 | drill 1.499 pad 2.159: 3 -3.505,1.245; 4 3.505,1.245
S03P = drill 1.016 long: 1 2.5,0; 2 0,0; 3 -2.5,0
MA04-1 = drill 1.016 long: 1 -3.81,0; 2 -1.27,0; 3 1.27,0; 4 3.81,0
RJ45 = drill 0.8: G+ 5.84,-6.305; G- 5.84,-3.765; GND -8.57,4.76; NC -6.03,3.5; P4 -8.57,-0.32; P5 -6.03,0.96; RD+ -6.03,-1.58; RD- -8.57,2.22; TD+ -6.03,-4.12; TD- -8.57,-2.86; Y+ 5.84,6.945; Y- 5.84,4.405 | drill 1.4: SHIELD1 -2.73,-7.425; SHIELD2 -2.73,8.065 | hole 3.5: 0.3,-5.38; 0.3,6.02
ESP01 = drill 0.8: CH_PD -1.285,-8.178; GPIO0 1.255,-5.638; GPIO2 -1.285,-5.638; RST 1.255,-8.178; TX -3.825,-8.178; VCC 3.795,-8.178 | drill 0.8 square: GND -3.825,-5.638; RX 3.795,-5.638
MSTBA10 = drill 1.397 long: 1 -22.86,5.08; 2 -17.78,5.08; 3 -12.7,5.08; 4 -7.62,5.08; 5 -2.54,5.08; 6 2.54,5.08; 7 7.62,5.08; 8 12.7,5.08; 9 17.78,5.08; 10 22.86,5.08
MSTBA6 = drill 1.397 long: 1 -12.7,5.08; 2 -7.62,5.08; 3 -2.54,5.08; 4 2.54,5.08; 5 7.62,5.08; 6 12.7,5.08

### Placement (x,y rotation side)
C2  55,80.5 180 top
EC1  51.25,34 0 top
EC2  51.25,36.75 0 top
EC3  32,43 270 top
EC4  51.25,31.5 180 top
EC5  51.25,28.75 180 top
EL1  60.25,42.25 270 top
ENC  40.75,37.75 270 top
ER1  30.75,35 180 top
ER2  30.75,38.25 180 top
ER3  49.5,47.25 180 top
ER4  45.25,47.25 180 top
ER6  60.25,36.75 90 top
ER7  56,36.75 90 top
ER8  56,31.25 90 top
ER9  60.25,31.25 90 top
ER10  33.25,32.25 180 top
IC1  14.75,37 270 top
IC2  15,32 270 top
IC3  15,27 270 top
IC4  15,21.75 270 top
IC5  15,16.75 270 top
IC6  14.5,10.5 270 top
IC7  15,4.75 270 top
ID1  17.75,37.25 0 top
ID2  18.25,30.75 0 top
ID3  23,26.25 0 top
ID4  18.25,22.5 0 top
ID5  23,16.5 0 top
ID6  23,9.5 0 top
ID7  18.5,7 0 top
IIR1  13,39.75 180 top
IIR2  13,34.5 180 top
IIR3  13,29.5 180 top
IIR4  13,24.5 180 top
IIR5  13,19.25 180 top
IIR6  13,14.25 180 top
IIR7  13,7.5 180 top
INDL  71.75,25.25 270 top
IR1  11.5,37 90 top
IR2  11.5,32 90 top
IR3  11.5,27 90 top
IR4  11.5,21.75 90 top
IR5  11.5,16.75 90 top
IR6  11.5,11.5 90 top
IR7  11.25,5 90 top
MC  54.5,76.25 180 top
NIR1  73.25,61.25 270 top
NIR2  73.25,73.75 270 top
NIR3  73.25,86.25 270 top
OD1  17,90.5 90 top
OD2  17,76 90 top
OD3  17.5,63.75 90 top
OL1  12.25,87.75 0 top
OL2  12.25,77.5 0 top
OL3  12.25,67.5 0 top
OQ1  28.25,88.5 90 top
OQ2  28.25,75.5 90 top
OQ3  28.5,62.5 90 top
OR1  41.25,90.5 270 top
OR2  41.5,77.5 270 top
OR3  41.5,62.5 270 top
PC1  32.75,23.5 270 top
PC2  59.75,15.5 270 top
PCO  33.25,9.25 0 top
PD1  66.5,5.5 180 top
PD2  47,22 180 top
PF1  59,5.5 180 top
PIC33  47.25,10.75 180 top
PJ1  82,10 180 top
PL  71.75,20 270 top
PP  72.25,51.25 90 top
PR1  67.25,20 180 top
Q2  53,42 0 top
R2  51.5,84 90 top
R6  67.25,25.25 0 top
SR  80.25,23.25 90 top
SV1  79.75,62.75 270 top
SV2  79.75,75.25 270 top
SV3  79.75,87.75 270 top
SV4  68.25,71 90 top
U$1  [IOTECH_COPPER_W_TEXT]  16,52.5 0 top
U$2  75,36 0 top
U$4  [IOTECH_COPPER_W_TEXT]  20,8 0 bottom
WIFI  30.75,38 270 top
XI  2,29.25 270 top
XO  2,77.75 270 top

### Tracks (layer width: path | path; a pad name or v marks a point on that pad's centre or on a via)
+3V3  (via drill 0.35)
  Top 0.203: 61.89,13.52 59.8,11.43 PC2.+ | 61.89,13.52 66.33,17.96 66.33,19.9 PR1.2 | 61.89,13.52 58.17,17.25 58.17,19.29 v45.51,31.94 44.39,33.06 44.39,33.47 ENC.15 | ER1.2 29.9,35 29.9,38.17 ER2.2 29.8,38.27 23.57,38.27 | 23.57,38.27 22.66,39.19 WIFI.CH_PD | 23.57,38.27 23.57,36.33 22.66,35.41 22.66,34.29 WIFI.VCC | NIR3.2 73.27,85.31 79.7,85.31 SV3.1 | NIR1.2 73.27,60.31 79.7,60.31 SV1.1 | NIR2.2 73.27,72.76 79.7,72.76 SV2.1 | R2.2 51.43,84.8 51.43,84.5 48.17,81.23 48.17,72.46 46.94,71.23 MC.VCC$1 | ENC.19 44.39,36.13 44.39,36.74 ENC.20 44.49,36.74 45.11,36.74 v45.72,37.35 | 49.39,43.98 49.09,43.98 45.41,40.31 | 49.39,43.98 55.82,43.98 56.64,43.17 60.21,43.17 EL1.1 | 45.41,40.31 45.21,40.11 44.39,40.11 ENC.25 | 48.37,48.17 49.19,48.17 49.39,47.96 49.39,43.98 | 48.37,48.17 48.07,48.17 47.86,47.96 47.86,46.33 44.39,42.86 44.39,42.05 ENC.28 | 45.41,40.31 v45.72,40 | v45.51,20.21 45.51,16.63 PIC33.4 | v37.35,13.47 33.27,13.47 PCO.P$1 | 48.37,48.17 v48.37,48.47
  Bottom 0.203: XI.3 7.14,41.94 19.9,41.94 22.55,39.29 WIFI.CH_PD | SV1.1 79.8,60.31 79.8,60.52 81.64,62.35 81.64,70.82 79.8,72.66 SV2.1 79.8,72.76 81.64,74.6 81.64,78.17 79.8,80.01 79.8,85.21 SV3.1 79.7,85.31 68.99,85.31 66.64,87.66 57.76,87.66 48.58,78.48 48.58,72.86 46.94,71.23 MC.VCC$1 46.94,71.13 46.94,70.42 48.37,68.99 v48.37,48.47 | v45.72,40 v45.72,37.35 45.51,37.15 45.51,33.78 | 45.51,33.78 v45.51,31.94 v45.51,20.21 44.39,20.21 37.66,13.47 v37.35,13.47 | 45.51,33.78 38.78,33.78 38.17,33.17 24.39,33.17 23.37,34.19 22.66,34.19 WIFI.VCC
A0
  Top 0.203: NIR3.1 73.27,87.15 79.19,87.15 79.7,87.66 SV3.2
  Bottom 0.203: MC.A0 46.94,81.33 50.82,81.33 59.7,90.21 77.25,90.21 79.7,87.76 SV3.2
A1  (via drill 0.35)
  Top 0.203: 13.98,37.96 14.7,37.96 IC1.1 14.8,37.96 15.1,38.27 17.66,38.27 ID1.3 17.76,38.37 v22.86,43.47 | 13.98,37.96 11.53,37.96 IR1.2 | 13.98,37.96 13.98,39.7 IIR1.1
  Bottom 0.203: v22.86,43.47 30.61,43.47 34.19,47.05 34.19,65.41 46.84,78.07 46.84,78.78 MC.A1
A2  (via drill 0.35)
  Top 0.203: IR2.2 11.53,32.96 12.35,32.96 13.88,34.49 IIR2.1 13.68,34.19 14.9,32.96 IC2.1 15,32.96 15.72,33.68 v16.12,33.68 | v17.14,32.45 17.66,31.94 18.16,31.94 ID2.3
  Bottom 0.203: v16.12,33.68 17.14,32.66 v17.14,32.45 17.14,32.76 22.14,37.76 26.12,37.76 36.02,47.66 36.02,62.86 46.84,73.68 MC.A3
A3  (via drill 0.35)
  Top 0.203: IR3.2 11.53,27.96 12.35,27.96 13.88,29.49 IIR3.1 13.68,29.19 14.9,27.96 IC3.1 15,27.86 15.31,27.55 v16.23,27.55 | v17.66,27.45 22.96,27.45 ID3.3
  Bottom 0.203: v16.23,27.55 16.33,27.45 v17.66,27.45 17.66,30.72 22.14,35.21 25,35.21 36.43,46.64 36.43,62.56 46.33,72.46 47.45,72.46 48.17,73.17 48.17,74.19 46.94,75.42 46.94,76.23 MC.A2
A4  (via drill 0.35)
  Top 0.203: 13.47,24.08 13.88,24.49 IIR4.1 | 13.47,24.08 12.04,22.66 11.53,22.66 IR4.2 | 13.47,24.08 14.9,22.66 IC4.1 15.92,23.57 v17.14,23.57 18.16,23.57 ID4.3 | v46.23,29.19 38.17,29.19 32.55,23.57 v20.92,23.57
  Bottom 0.203: v46.23,29.19 46.23,36.64 70.11,60.52 70.11,72.76 68.27,74.6 68.27,74.8 SV4.4 | v17.14,23.57 v20.92,23.57
A5  (via drill 0.35)
  Top 0.203: IR5.2 11.53,17.66 12.35,17.66 13.88,19.18 IIR5.1 13.68,18.88 14.9,17.66 IC5.1 v16.23,17.66 | v17.66,17.66 22.96,17.66 ID5.3 | v34.59,27.55 v41.53,34.49
  Bottom 0.203: v16.23,17.66 v17.66,17.66 18.47,17.66 28.37,27.55 v34.59,27.55 | v41.53,34.49 42.35,35.31 42.35,37.66 45.41,40.72 47.15,40.72 63.78,57.35 63.78,67.56 68.17,71.94 68.17,72.25 SV4.3
A6  (via drill 0.35)
  Top 0.203: 12.81,13.11 13.88,14.19 IIR6.1 | 12.81,13.11 12.14,12.45 11.53,12.45 IR6.2 11.43,12.35 9.18,10.1 7.76,10.1 4.59,6.94 4.59,5.82 7.35,3.06 18.37,3.06 22.81,7.5 | 12.81,13.11 14.49,11.43 IC6.1 | 22.81,7.5 22.96,7.65 22.96,10.51 ID6.3 | v70.52,59.8 70.52,67.25 68.27,69.5 68.27,69.7 SV4.2 | 22.81,7.5 v27.14,3.16
  Bottom 0.203: v70.52,59.8 70.52,55.62 70.01,55.11 70.01,34.09 68.78,32.86 68.58,32.86 47.35,11.63 47.35,10.61 38.68,1.94 28.37,1.94 v27.14,3.16
A7  (via drill 0.35)
  Top 0.203: IR7.2 11.33,5.92 12.35,5.92 13.88,7.45 IIR7.1 13.57,7.04 14.9,5.71 IC7.1 15,5.71 17.35,8.06 | 17.35,8.06 18.47,8.06 ID7.3 | v69.8,59.09 68.27,60.62 68.27,67.15 SV4.1 | 17.35,8.06 v17.35,8.27
  Bottom 0.203: v69.8,59.09 69.29,59.09 46.94,36.74 46.94,10.82 40,3.88 38.27,3.88 37.86,4.29 27.96,4.29 27.66,3.98 26.64,3.98 21.84,8.78 21.84,9.08 20.82,10.1 19.18,10.1 v17.35,8.27
D2  (via drill 0.35)
  Top 0.203: v58.07,69.7 43.58,55.21 43.58,45.72 37.96,40.11 37.15,40.11 ENC.4
  Bottom 0.203: v58.07,69.7 62.05,73.68 MC.D2
D3  (via drill 0.35)
  Top 0.203: v57.05,70.82 v35.31,49.09
  Bottom 0.203: v35.31,49.09 35.31,47.55 30.82,43.06 24.59,43.06 23.37,41.84 22.66,41.84 WIFI.TX | v57.05,70.82 57.05,71.23 62.05,76.23 MC.D3
D4
  Bottom 0.203: WIFI.RX 25.21,34.29 37.45,34.29 53.68,50.52 54.29,50.52 63.37,59.6 63.37,77.56 62.15,78.78 MC.D4
D5
  Top 0.203: OQ3.1 37.45,60.01 38.98,61.54 41.43,61.54 OR3.2 41.53,61.64 47.25,61.64 50.41,64.8 50.41,78.27 53.58,81.44 56.43,81.44 56.54,81.33 62.05,81.33 MC.D5
D6
  Top 0.203: OQ2.1 40.72,76.54 41.43,76.54 OR2.2 41.53,76.64 41.84,76.64 42.86,77.66 42.86,84.19 46.33,87.66 50.21,87.66 53.98,83.89 62.05,83.89 MC.D6
D7
  Top 0.203: OQ1.1 37.15,86.03 40.72,89.6 41.23,89.6 OR1.2 41.33,89.7 41.84,90.21 48.27,90.21 52.05,86.44 62.05,86.44 MC.D7
D8
  Top 0.203: SV1.2 79.7,62.66 79.29,62.25 73.27,62.25 NIR1.1 73.27,62.35 72.25,63.37 72.25,73.17 64.6,80.82 64.6,85.72 62.15,88.17 62.15,88.89 MC.D8
D9
  Top 0.203: SV2.2 79.7,75.21 79.19,74.7 73.27,74.7 NIR2.1 73.27,74.8 73.27,81.03 62.86,91.44 62.15,91.44 MC.D9
D10  (via drill 0.35)
  Top 0.203: ENC.9 37.04,36.84 34.49,36.84 33.17,38.17 31.74,38.17 ER2.1 31.64,38.27 31.64,39.29 29.08,41.84 v29.08,44.19
  Bottom 0.203: v29.08,44.19 29.49,44.19 29.8,43.88 30.41,43.88 33.78,47.25 33.78,78.37 46.84,91.44 MC.D10
D11  (via drill 0.35)
  Top 0.203: v30.11,44.6 30.11,41.43 31.33,40.21 31.74,40.21 33.78,38.17 37.04,38.17 ENC.7
  Bottom 0.203: v30.11,44.6 30.11,76.54 46.33,92.76 47.45,92.76 48.17,92.05 48.17,90.21 46.94,88.99 MC.D11
D12  (via drill 0.35)
  Top 0.203: v43.58,44.39 37.96,38.78 37.15,38.78 ENC.6 | v43.58,68.68 43.58,83.07 46.84,86.33 MC.D12
  Bottom 0.203: v43.58,68.68 v43.58,44.39
D13  (via drill 0.35)
  Top 0.203: v50.11,44.7 53.98,44.7 | 53.98,44.7 60.21,44.7 65.21,39.7 66.33,39.7 67.56,38.47 69.5,38.47 70.42,37.55 70.42,31.94 66.44,27.96 66.44,25.31 R6.1 | v41.64,37.45 37.15,37.45 ENC.8 | v49.7,65.11 47.45,67.35 46.33,67.35 45.62,68.07 45.62,81.84 46.84,83.07 46.84,83.78 MC.D13 | 53.98,44.7 v53.98,51.23
  Bottom 0.203: v50.11,44.7 48.78,44.7 41.64,37.55 v41.64,37.45 | v49.7,65.11 49.7,55.52 v53.98,51.23
DTR
  Top 0.203: C2.2 54.19,80.42 54.19,74.7 61.54,67.35 62.66,67.35 63.58,66.44 63.58,63.68 72.15,55.11 PP.1
EP4
  Top 0.203: ER6.2 60.31,37.66 60.31,41.33 EL1.2 | EC4.1 52.25,31.53 52.25,32.66 55.01,35.41 55.01,36.64 55.92,37.55 ER7.2 56.02,37.66 60.21,37.66 ER6.2 | U$2.P4 66.33,35.72 63.17,35.72 61.23,37.66 60.41,37.66 ER6.2
EP5
  Top 0.203: EC5.1 52.25,28.78 54.39,28.78 55.92,30.31 ER8.1 56.02,30.41 60.21,30.41 ER9.1 60.31,30.41 63.07,30.41 65.21,32.55 65.21,33.37 66.03,34.19 66.94,34.19 68.88,36.13 68.88,36.94 U$2.P5
GND  (via drill 0.35)
  Top 0.203: EC1.2 52.15,34.09 52.15,36.74 EC2.2 52.25,36.84 v54.29,36.84 | U$2.GND 66.44,40.82 69.6,43.98 72.25,43.98 U$2.SHIELD2 72.35,44.09 73.07,44.09 74.09,45.11 76.54,45.11 80.82,40.82 80.82,40.41 U$2.Y- 80.82,40.31 80.82,32.25 U$2.G- | EC4.2 50.41,31.43 50.41,28.78 EC5.2 50.41,28.68 50.41,28.37 59.09,19.7 59.7,19.7 PC2.- 59.8,19.7 64.6,19.7 65.82,20.92 72.86,20.92 | 72.86,20.92 72.86,25.21 INDL.C | 72.86,20.92 72.86,20 PL.C | INDL.C 72.76,25.31 72.76,28.17 72.35,28.57 U$2.SHIELD1 | PJ1.GND 82.05,15.72 82.05,20 82.66,20.61 82.66,24.29 81.54,25.41 SR.2 81.44,25.41 81.23,25.21 72.97,25.21 INDL.C | MC.GND$4 62.15,71.13 69.19,71.13 71.84,68.48 71.84,62.05 72.46,61.43 80.72,61.43 81.64,62.35 81.64,63.37 79.8,65.21 SV1.3 79.8,65.31 79.8,70.52 81.64,72.35 81.64,75.82 79.8,77.66 SV2.3 79.8,77.76 81.64,79.6 81.64,88.17 79.8,90.01 79.8,90.21 SV3.3 79.7,90.31 77.25,92.76 41.13,92.76 39.49,91.13 37.15,91.13 OQ1.3 | PIC33.5 43.88,16.53 43.88,16.12 44.9,15.1 46.23,15.1 47.25,16.12 PIC33.3 | PD2.A 44.8,21.94 44.8,17.86 43.88,16.94 43.88,16.63 PIC33.5 | IR6.1 11.53,10.51 13.68,10.51 14.49,9.7 IC6.2 14.59,9.59 18.68,9.59 20.16,8.11 | IR7.1 11.33,4.08 14.7,4.08 14.9,3.88 IC7.2 15,3.88 16.94,5.82 17.45,5.82 ID7.1 17.55,5.92 18.57,6.94 18.98,6.94 20.16,8.11 | 20.16,8.11 20.41,8.37 22.04,8.37 ID6.1 22.04,8.47 22.04,15.31 ID5.1 | PIC33.5 43.78,16.53 23.27,16.53 22.14,15.41 ID5.1 | 12.25,80.62 12.25,85.01 11.33,85.93 11.33,87.86 12.25,88.78 OL1.C | 12.25,80.62 12.25,78.58 OL2.C | 33.62,72.81 34.9,74.09 34.9,75.82 37.04,77.97 OQ2.3 37.15,77.97 37.45,77.66 42.25,77.66 42.45,77.86 42.45,78.89 39.39,81.95 20.92,81.95 19.59,80.62 12.25,80.62
  Top 0.203: 33.62,72.81 30.21,69.39 16.02,69.39 15.21,68.58 12.35,68.58 OL3.C | 33.62,72.81 42.45,63.98 42.45,62.86 42.25,62.66 40.72,62.66 38.37,65.01 37.45,65.01 OQ3.3 37.45,64.9 37.45,63.48 30.72,56.74 30.72,45.51 30.46,45.26 | 43.32,35.77 43.27,35.82 43.27,37.15 43.47,37.35 44.29,37.35 ENC.21 44.39,37.45 44.39,38.06 ENC.22 | 43.32,35.77 43.58,35.51 44.29,35.51 ENC.18 44.39,35.51 45.21,35.51 46.13,36.43 v47.66,36.43 | 43.32,35.77 43.27,35.72 38.17,35.72 37.96,35.51 37.15,35.51 ENC.11 37.04,35.41 36.23,35.41 33.98,33.17 33.27,33.17 32.45,32.35 ER10.2 32.45,32.25 32.45,27.86 32.66,27.66 PC1.- 32.45,27.76 25.1,27.76 23.57,26.23 23.16,26.23 22.14,25.21 ID3.1 22.04,25.1 21.43,25.1 20,23.68 | IR3.1 11.53,26.12 14.9,26.12 IC3.2 15.1,26.12 15.82,26.12 16.68,26.99 | IR2.1 11.53,31.12 14.9,31.12 IC2.2 | 16.94,29.7 16.33,29.7 15,31.02 IC2.2 | 16.94,29.7 17.25,29.7 ID2.1 16.94,29.7 | 16.68,26.99 16.94,27.25 16.94,29.7 | IR5.1 11.53,15.82 14.9,15.82 IC5.2 15,15.92 15.51,15.92 16.89,17.3 | IR4.1 11.53,20.82 14.9,20.82 IC4.2 15,20.92 15.41,21.33 16.94,21.33 | 16.94,21.33 17.25,21.33 ID4.1 | 20,23.68 18.78,22.45 18.37,22.45 17.35,21.43 ID4.1 | 16.89,17.3 16.94,17.35 16.94,21.33 | 16.94,21.33 ID4.1 | 20,23.68 16.68,26.99 | ENC.2 37.04,41.33 32.25,41.33 32.04,41.53 EC3.- 31.94,41.64 31.94,42.35 30.82,43.47 30.82,44.9 30.46,45.26 | ID1.1 16.74,36.13 14.8,36.13 IC1.2 14.7,36.13 11.53,36.13 IR1.1 11.53,36.23 10.51,37.25 10.51,38.37 10.82,38.68 12.55,38.68 12.86,38.98 12.86,40.51 7.14,46.23 7.14,46.94 XI.2 | ID1.1 16.84,36.23 17.86,37.25 18.37,37.25 21.43,40.31 22.45,40.31 23.88,41.74 25.1,41.74 WIFI.GND 25.21,41.84 28.68,45.31 30.41,45.31 30.46,45.26
  Top 0.203: IC2.2 14.9,31.23 16.84,33.17 16.84,36.13 ID1.1 | 16.89,17.3 18.78,15.41 ID5.1
  Bottom 0.203: U$2.SHIELD2 72.35,44.09 74.09,45.82 74.09,50.62 72.25,52.45 PP.2 72.25,52.56 72.25,52.76 77.86,58.37 77.86,63.37 79.7,65.21 SV1.3 | U$2.GND 66.33,40.72 62.45,36.84 v54.29,36.84 48.07,36.84 v47.66,36.43 | U$2.G- 80.93,32.15 80.93,31.02 81.84,30.11 81.84,25.82 81.54,25.51 SR.2
LEDA
  Top 0.203: ER3.1 50.41,47.35 50.41,48.68 53.68,51.94 64.8,51.94 71.23,45.51 78.27,45.51 80.82,42.96 U$2.Y+
LEDB
  Top 0.203: ER4.1 46.23,47.35 51.23,52.35 65.01,52.35 71.44,45.92 79.29,45.92 81.84,43.37 81.84,30.61 80.93,29.7 U$2.G+
N$1
  Top 0.203: OQ3.2 25.92,62.45 25.1,61.64 17.55,61.64 OD3.A 17.45,61.64 14.08,65.01 7.14,65.01 XO.6
N$2
  Top 0.203: PD1.C 64.29,5.51 61.54,5.51 PF1.1
N$3
  Top 0.203: OQ1.2 25.61,88.48 25.51,88.38 17.04,88.38 OD1.A 16.94,88.38 15.51,89.8 11.53,89.8 7.14,85.42 XO.2
N$4
  Top 0.203: OQ2.2 25.61,75.42 24.08,73.88 17.04,73.88 OD2.A 16.94,73.88 12.35,73.88 11.12,75.11 7.14,75.11 XO.4
N$5
  Top 0.203: R6.2 68.17,25.31 70.62,25.31 INDL.A
N$6
  Top 0.203: OR3.1 41.43,63.48 41.43,64.39 37.25,68.58 15.82,68.58 13.78,66.54 12.35,66.54 OL3.A
N$7
  Top 0.203: OL2.A 12.35,76.54 13.37,76.54 17.04,80.21 19.8,80.21 21.12,81.54 38.37,81.54 41.43,78.48 OR2.1
N$8
  Top 0.203: OL1.A 12.35,86.64 17.66,86.64 20.92,83.38 20.92,82.66 21.12,82.46 30.31,82.46 34.9,87.05 34.9,87.15 37.35,89.6 39.49,89.6 41.23,91.33 OR1.1
N$9
  Top 0.203: ER3.2 48.58,47.25 48.58,44.7 45.21,41.33 44.39,41.33 ENC.27
N$11
  Top 0.203: PR1.1 68.17,20 70.62,20 PL.A
N$12
  Top 0.203: IIR1.2 12.04,39.7 9.9,39.7 7.14,36.94 XI.4
N$13
  Top 0.203: ENC.1 37.04,42.05 34.39,42.05 32.04,44.39 EC3.+
N$14
  Top 0.203: ER4.2 44.29,47.25 44.29,43.37 43.27,42.35 43.27,41.02 43.58,40.72 44.29,40.72 ENC.26
N$16
  Top 0.203: PD2.C 49.19,21.94 48.98,21.74 48.98,16.63 PIC33.2 48.88,16.53 48.88,16.12 47.45,14.7 38.88,14.7 38.06,13.88 38.06,9.8 33.27,5 PCO.P$2
N$17
  Top 0.203: ER1.1 31.74,35 35.21,35 36.23,36.02 37.04,36.02 ENC.10
N$18
  Top 0.203: PD1.A 68.68,5.51 73.99,5.51 74.29,5.82 80.52,5.82 81.95,4.39 PJ1.VIN0
N$19
  Top 0.203: ER10.1 34.19,32.35 35.92,32.35 37.04,33.47 ENC.14
N$20
  Top 0.203: IIR2.2 12.04,34.49 9.8,34.49 7.14,31.84 XI.5
N$21
  Top 0.203: IIR3.2 12.04,29.49 9.9,29.49 7.14,26.74 XI.6
N$22
  Top 0.203: 50.41,39.29 50.41,41.23 51.13,41.94 Q2.1 | 50.41,39.29 50.41,36.84 EC2.1 | 50.41,39.29 44.39,39.29 ENC.24
N$23
  Top 0.203: IIR4.2 12.04,24.49 10,24.49 7.14,21.64 XI.7
N$24
  Top 0.203: 50.16,34.95 46.43,38.68 44.39,38.68 ENC.23 | 50.16,34.95 50.31,34.8 50.31,34.09 EC1.1 | 50.16,34.95 51.13,35.92 51.13,37.25 54.8,40.92 54.8,41.94 Q2.2
N$25
  Top 0.203: IIR5.2 12.04,19.18 9.7,19.18 7.14,16.63 XI.8
N$26
  Top 0.203: IIR6.2 12.04,14.19 9.8,14.19 7.14,11.53 XI.9
N$27
  Top 0.203: IIR7.2 12.04,7.45 8.16,7.45 7.14,6.43 XI.10
RAW_IV  (via drill 0.35)
  Top 0.254: PF1.2 56.43,5.51 56.43,10.1 50.72,15.82 50.72,16.53 PIC33.1 50.82,16.53 50.82,23.27 50.52,23.57 43.47,23.57 39.29,19.39 32.76,19.39 PC1.+ 32.66,19.39 26.12,19.39 v22.66,22.86 | OD1.C 16.94,92.56 9.18,92.56 7.14,90.52 XO.1 7.04,90.42 7.04,88.38 4.59,85.93 4.59,82.86 7.04,80.42 XO.3 7.14,80.21 7.14,79.8 7.81,79.14 | 7.81,79.14 11.43,75.52 13.06,75.52 15.61,78.07 16.94,78.07 OD2.C | 7.91,69.04 7.14,69.8 7.14,70.11 XO.5 7.04,70.21 4.59,72.66 4.59,75.92 7.81,79.14 | 7.91,69.04 11.43,65.52 13.06,65.52 13.37,65.82 17.45,65.82 OD3.C | 7.91,69.04 4.59,65.72 4.59,64.5 7.04,62.05 7.04,52.15 XI.1
  Bottom 0.254: v22.66,22.86 18.78,26.74 16.02,26.74 9.59,33.17 9.59,37.45 6.53,40.51 5.51,40.51 4.59,41.43 4.59,49.6 7.04,52.05 XI.1
RD+  (via drill 0.35)
  Top 0.203: v64.5,32.86 59.49,32.86 58.88,32.25 56.02,32.25 ER8.2 | v39.09,33.06 38.06,34.09 37.15,34.09 ENC.13 | v48.37,28.06 v44.09,28.06
  Bottom 0.203: U$2.RD+ 68.88,34.39 66.23,34.39 64.7,32.86 v64.5,32.86 59.7,28.06 v48.37,28.06 | v44.09,28.06 v39.09,33.06
RD-  (via drill 0.35)
  Top 0.203: v61.43,32.15 60.31,32.15 ER9.2 | v47.66,28.78 43.27,33.17 43.27,33.78 41.84,35.21 41.23,35.21 40.92,34.9 37.15,34.9 ENC.12
  Bottom 0.203: U$2.RD- 66.33,38.17 61.43,33.27 v61.43,32.15 58.07,28.78 v47.66,28.78
RESET  (via drill 0.35)
  Top 0.203: C2.1 55.92,80.42 55.92,74.8 62.05,68.68 MC.RST$2 62.15,68.58 63.98,66.74 63.98,63.88 69.5,58.37 71.23,58.37 v78.37,51.23 | v51.53,80.42 51.53,83.07 R2.1
  Bottom 0.203: v51.53,80.42 51.53,75.21 58.07,68.68 62.05,68.68 MC.RST$2 | v78.37,51.23 78.37,30.72 80.52,28.57 80.52,26.23 80.42,26.12 80.42,25 81.44,23.98 81.44,21.02 SR.1
RXI
  Top 0.203: PP.4 72.15,47.45 72.15,47.76 60.82,59.09 60.82,64.8 62.05,66.03 MC.RX1$1
TD+  (via drill 0.35)
  Top 0.203: U$2.TD+ 68.99,31.94 70.01,32.96 70.01,37.35 69.39,37.96 68.58,37.96 67.97,37.35 67.97,35.82 66.84,34.7 63.58,34.7 62.45,35.82 60.31,35.82 ER6.1 60.21,35.82 v59.29,34.9 | v49.19,34.9 44.39,34.9 ENC.17
  Bottom 0.203: v59.29,34.9 v49.19,34.9
TD-
  Top 0.203: 51.48,30.67 51.13,31.02 51.13,32.25 50.31,33.06 46.23,33.06 45.21,34.09 44.39,34.09 ENC.16 | 51.48,30.67 51.64,30.51 52.66,30.51 55.92,33.78 55.92,35.82 ER7.1 | U$2.TD- 66.33,33.06 61.03,27.76 51.64,27.76 51.43,27.96 51.43,30.61 51.48,30.67
TXO
  Top 0.203: PP.3 72.15,50.01 72.15,50.31 62.15,60.31 62.15,63.48 MC.TX0$1

### Text on the board
tPlace: IOTECH © 2019 | www.iotech.com.tr | IOTB v1.1a TOP | S/N:
bPlace: IOTECH | IOTB BOT